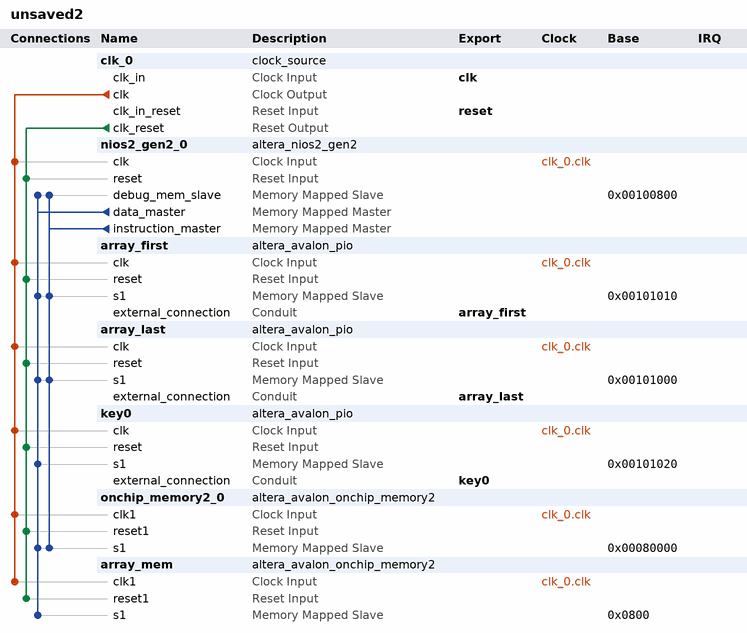
[diagram p0: system contents]
# Platform Designer (Qsys) system unsaved2, Cyclone V 5CEBA4F23C7
# Parameters at their usual value, and those the tool derives, are not listed.
package require -exact qsys 20.1
create_system unsaved2
set_project_property DEVICE_FAMILY {Cyclone V}
set_project_property DEVICE 5CEBA4F23C7

add_instance clk_0 clock_source 20.1
set_instance_parameter_value clk_0 clockFrequency 50000000

add_instance nios2_gen2_0 altera_nios2_gen2 20.1
set_instance_parameter_value nios2_gen2_0 dcache_size 2048
set_instance_parameter_value nios2_gen2_0 exceptionSlave onchip_memory2_0.s1
set_instance_parameter_value nios2_gen2_0 icache_size 4096
set_instance_parameter_value nios2_gen2_0 impl Tiny
set_instance_parameter_value nios2_gen2_0 resetSlave onchip_memory2_0.s1

add_instance array_first altera_avalon_pio 20.1
set_instance_parameter_value array_first direction Output
set_instance_parameter_value array_first width 4

add_instance array_last altera_avalon_pio 20.1
set_instance_parameter_value array_last direction Output
set_instance_parameter_value array_last width 4

add_instance key0 altera_avalon_pio 20.1
set_instance_parameter_value key0 direction Input
set_instance_parameter_value key0 simDoTestBenchWiring true
set_instance_parameter_value key0 width 1

add_instance onchip_memory2_0 altera_avalon_onchip_memory2 20.1
set_instance_parameter_value onchip_memory2_0 dataWidth 32
set_instance_parameter_value onchip_memory2_0 dualPort false
set_instance_parameter_value onchip_memory2_0 initMemContent true
set_instance_parameter_value onchip_memory2_0 initializationFileName onchip_mem.hex
set_instance_parameter_value onchip_memory2_0 memorySize 250000

add_instance array_mem altera_avalon_onchip_memory2 20.1
set_instance_parameter_value array_mem dataWidth 32
set_instance_parameter_value array_mem dualPort false
set_instance_parameter_value array_mem initMemContent true
set_instance_parameter_value array_mem initializationFileName A:/quartus/ece5722hw5/ece5722hw5.hex
set_instance_parameter_value array_mem memorySize 64
set_instance_parameter_value array_mem useNonDefaultInitFile true

# connections
add_connection clk_0.clk array_first.clk clock
add_connection clk_0.clk array_last.clk clock
add_connection clk_0.clk array_mem.clk1 clock
add_connection clk_0.clk key0.clk clock
add_connection clk_0.clk nios2_gen2_0.clk clock
add_connection clk_0.clk onchip_memory2_0.clk1 clock
add_connection clk_0.clk_reset array_first.reset reset
add_connection clk_0.clk_reset array_last.reset reset
add_connection clk_0.clk_reset array_mem.reset1 reset
add_connection clk_0.clk_reset key0.reset reset
add_connection clk_0.clk_reset nios2_gen2_0.reset reset
add_connection clk_0.clk_reset onchip_memory2_0.reset1 reset
add_connection nios2_gen2_0.data_master array_first.s1 avalon
set_connection_parameter_value nios2_gen2_0.data_master/array_first.s1 baseAddress 0x00101010
add_connection nios2_gen2_0.data_master array_last.s1 avalon
set_connection_parameter_value nios2_gen2_0.data_master/array_last.s1 baseAddress 0x00101000
add_connection nios2_gen2_0.data_master array_mem.s1 avalon
set_connection_parameter_value nios2_gen2_0.data_master/array_mem.s1 baseAddress 0x0800
add_connection nios2_gen2_0.data_master key0.s1 avalon
set_connection_parameter_value nios2_gen2_0.data_master/key0.s1 baseAddress 0x00101020
add_connection nios2_gen2_0.data_master nios2_gen2_0.debug_mem_slave avalon
set_connection_parameter_value nios2_gen2_0.data_master/nios2_gen2_0.debug_mem_slave baseAddress 0x00100800
add_connection nios2_gen2_0.data_master onchip_memory2_0.s1 avalon
set_connection_parameter_value nios2_gen2_0.data_master/onchip_memory2_0.s1 baseAddress 0x00080000
add_connection nios2_gen2_0.instruction_master array_first.s1 avalon
set_connection_parameter_value nios2_gen2_0.instruction_master/array_first.s1 baseAddress 0x00101010
add_connection nios2_gen2_0.instruction_master array_last.s1 avalon
set_connection_parameter_value nios2_gen2_0.instruction_master/array_last.s1 baseAddress 0x00101000
add_connection nios2_gen2_0.instruction_master nios2_gen2_0.debug_mem_slave avalon
set_connection_parameter_value nios2_gen2_0.instruction_master/nios2_gen2_0.debug_mem_slave baseAddress 0x00100800
add_connection nios2_gen2_0.instruction_master onchip_memory2_0.s1 avalon
set_connection_parameter_value nios2_gen2_0.instruction_master/onchip_memory2_0.s1 baseAddress 0x00080000

# exported interfaces
add_interface array_first conduit end
set_interface_property array_first EXPORT_OF array_first.external_connection
add_interface array_last conduit end
set_interface_property array_last EXPORT_OF array_last.external_connection
add_interface clk clock sink
set_interface_property clk EXPORT_OF clk_0.clk_in
add_interface key0 conduit end
set_interface_property key0 EXPORT_OF key0.external_connection
add_interface reset reset sink
set_interface_property reset EXPORT_OF clk_0.clk_in_reset

set_interconnect_requirement {$system} qsys_mm.clockCrossingAdapter HANDSHAKE
set_interconnect_requirement {$system} qsys_mm.enableEccProtection FALSE
set_interconnect_requirement {$system} qsys_mm.insertDefaultSlave FALSE
set_interconnect_requirement {$system} qsys_mm.maxAdditionalLatency 1

save_system unsaved2.qsys
